# Altium schematic sheet Encoder.SchDoc: Encoder
size A4; Author: Nikola Rašević; Organization: Memristor-Robotics; Address1: Vladimira Periá Valtera 2; Address2: 21000 Novi Sad; Address3: Serbia; SheetNumber: 11; SheetTotal: 11
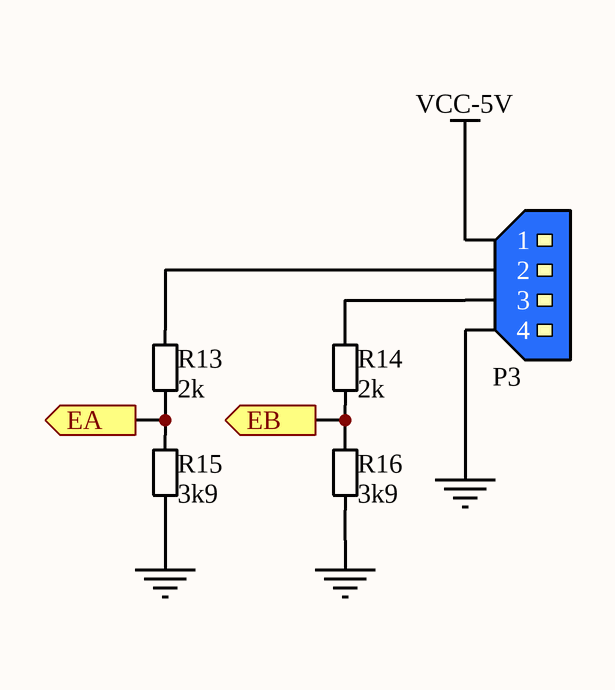
[diagram p0: Encoder.SchDoc]

## Parts
P3  TE CONNECTIVITY_4PIN_MALE  [TE CONNECTIVITY_4PIN_MALE]  (value not drawn)
R13  2k  [RESC2013X38N-0805-NOOVERLAY]
R14  2k  [RESC2013X38N-0805-NOOVERLAY]
R15  3k9  [RESC2013X38N-0805-NOOVERLAY]
R16  3k9  [RESC2013X38N-0805-NOOVERLAY]

## Ports
EA (out), EB (out)

## Nets
GND: P3.4 R15.1 R16.1
VCC-5V: P3.1
EA: R13.1 R15.2 ; port EA
EB: R14.1 R16.2 ; port EB
NetP3_2: P3.2 R13.2
NetP3_3: P3.3 R14.2

## Notes on the sheet
- Title
- Date:
- Design Engineer:
- Time:
- Revision:
- Sheet
- of
- Size:
- A4
- www.memristor-robotics.io
- File:

## Library data of the parts
P3 = TE CONNECTIVITY_4PIN_MALE: BLUE_4PIN_CONECTOR; Manufacturer: TE CONNECTIVITY / AMP; Manufacturer Part Number 1: 281695-3; Order Code 1: 1205983; Price 1: £0.403; Supplier 1: uk.farnell.com
R13 R14 = 00002001: RES SMD 2 kOhm 1/8W 0805; Power: 0.125W, 1/8W; Barcode: 00009101; Resistance: 2k; Assembly: SMD
R15 R16 = 00003901: RES SMD 3.9 kOhm 1/8W 0805; Power: 0.125W, 1/8W; Barcode: 00009101; Resistance: 3k9; Assembly: SMD